# Altium schematic sheet Delenda.SchDoc: Top Sheet
size A3; SheetNumber: 1; SheetTotal: 6; DocumentName: Top Sheet
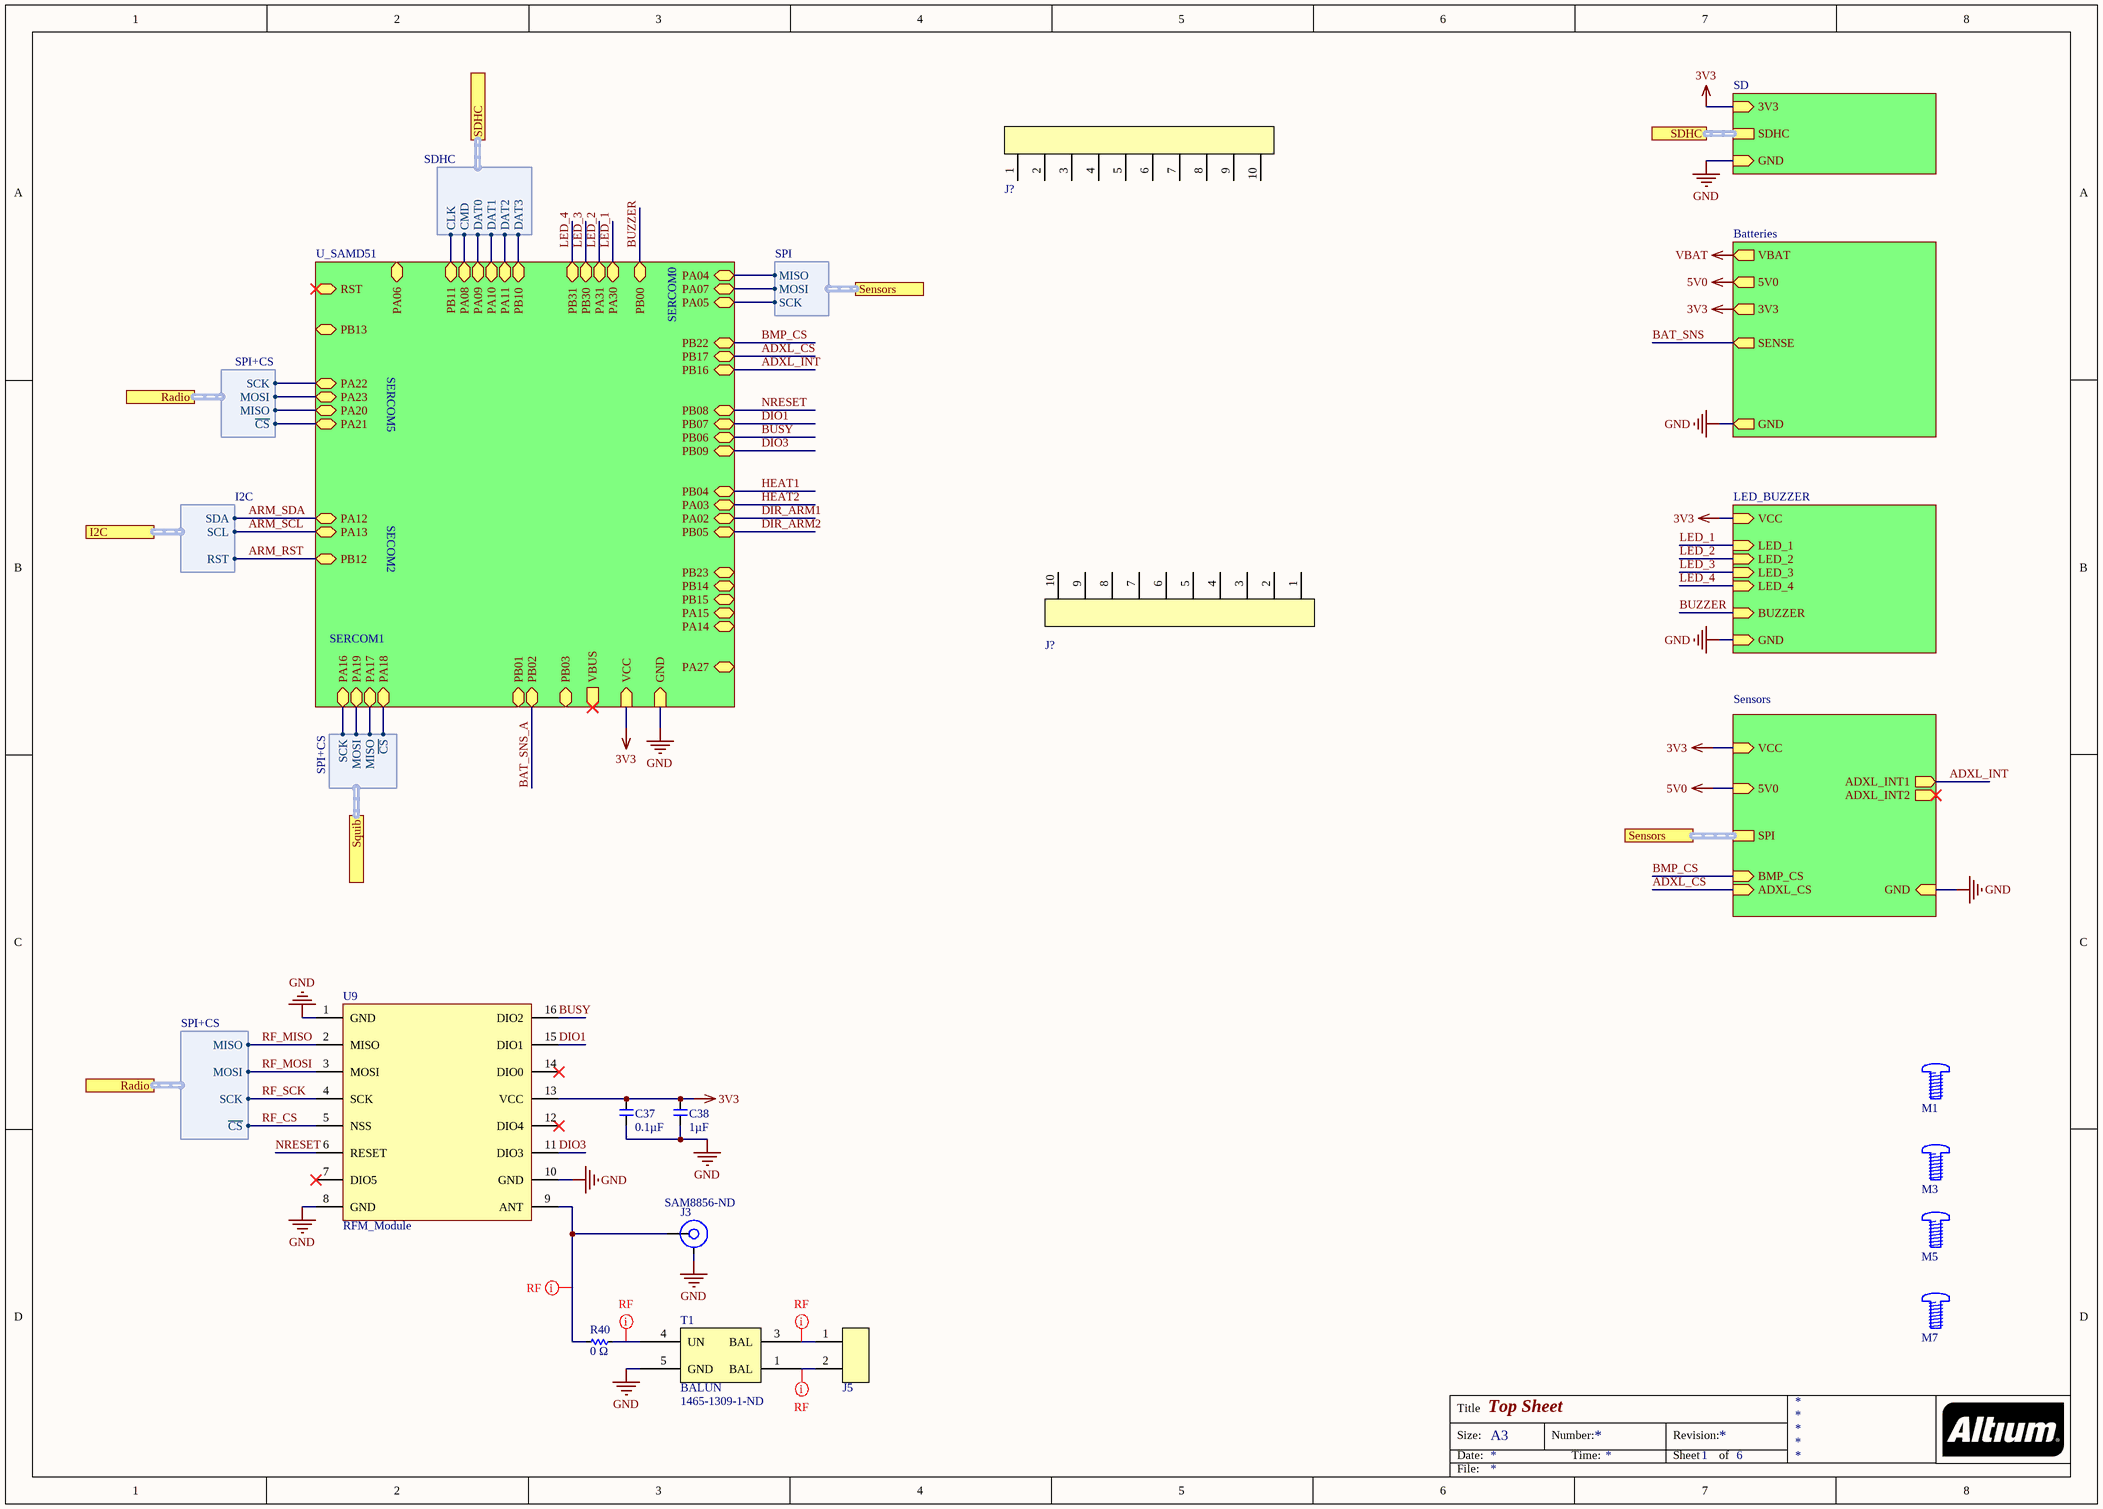
[diagram p0: Delenda.SchDoc]

## Parts
(Parts that share a designator on the sheet are numbered #1, #2 ... from top to bottom, then left to right.)
C37  Capacitance (shorthand): 0.1µF  [C0603]  (hidden comment: __template_cap)
C38  Capacitance (shorthand): 1µF  [C0603]  (hidden comment: __template_cap)
J3  Supplier Part Number 1: SAM8856-ND  [SMA_SAMTEC_SMA-J-P-X-RA-TH1]  (hidden comment: SMA_SAMTEC_TH_RA)
J5  CONN HEADER 2POS VERT T/H  [CONN_1x2_100MIL]  (value not drawn)
J?#1  CONN HEADER 10POS T/H  [CONN_1x10_100MIL]  (value not drawn)
J?#2  CONN HEADER 10POS T/H  [CONN_1x10_100MIL]  (value not drawn)
M1  SCREW_#4-40  [#4_HOLE]  (value not drawn)
M3  SCREW_#4-40  [#4_HOLE]  (value not drawn)
M5  SCREW_#4-40  [#4_HOLE]  (value not drawn)
M7  SCREW_#4-40  [#4_HOLE]  (value not drawn)
R40  Resistance: 0 Ω  [R0402]  (hidden comment: __template_resistor)
T1  BALUN  Supplier Part Number 1: 1465-1309-1-ND  [BALUN_MABA-010245-CT1160]
U9  RFM_Module  [RFM-22]

## Sub-sheets
Batteries = Battery_Management: SENSE (out), 5V0 (out), GND (out), 3V3 (out), VBAT (out)
LED_BUZZER = Blink_Blink_Beep_Boop: LED_1 (in), LED_2 (in), LED_3 (in), LED_4 (in), BUZZER (in), GND (in), VCC (in)
SD = SD.SchDoc: SDHC (harness SDHC), GND (in), 3V3 (in)
Sensors = Sensors.SchDoc: SPI (harness SPI), BMP_CS (in), ADXL_CS (in), ADXL_INT1 (out), ADXL_INT2 (out), GND (in), VCC (in), 5V0 (in)
U_SAMD51 = SAMD51.SchDoc: PA12 (bidir), PA13 (bidir), PA05 (bidir), PA07 (bidir), PA04 (bidir), PA06 (bidir), PB11 (bidir), PA08 (bidir), PA09 (bidir), PA10 (bidir), PA11 (bidir), PB10 (bidir), PB12 (bidir), PB13 (bidir), PA22 (bidir), PA23 (bidir), PA16 (bidir), PA19 (bidir), PA17 (bidir), PA20 (bidir), PA21 (bidir), PB08 (bidir), PB07 (bidir), PB06 (bidir), PB09 (bidir), PB04 (bidir), PA03 (bidir), PA02 (bidir), PB05 (bidir), PB00 (bidir), PB30 (bidir), PA31 (bidir), PA30 (bidir), PB31 (bidir), PB16 (bidir), PA14 (bidir), PB17 (bidir), PB23 (bidir), PB22 (bidir), PA27 (bidir), PB02 (bidir), PB01 (bidir), PB03 (bidir), PA18 (bidir), GND (in), VCC (in), VBUS (out), PB14 (bidir), PB15 (bidir), PA15 (bidir), RST (bidir)

## Ports
I2C (harness I2C), Radio (harness SPI+CS), SDHC, SDHC (harness SDHC), Sensors (harness SPI), Squib (harness SPI+CS)

## Harnesses
SPI: MISO, MOSI, SCK
SDHC: CLK, CMD, DAT0, DAT1, DAT2, DAT3
SPI+CS: MISO, MOSI, SCK, ~{CS}
I2C: SCL, SDA, RST

## Nets
3V3: C37.1 C38.1 U9.13(VCC) ; sheet Sensors/VCC, sheet Batteries/3V3, sheet LED_BUZZER/VCC, sheet U_SAMD51/VCC, sheet SD/3V3
5V0: sheet Sensors/5V0, sheet Batteries/5V0
GND: C37.2 C38.2 J3.GND T1.5(GND) U9.1(GND) U9.8(GND) U9.10(GND) ; sheet Sensors/GND, sheet Batteries/GND, sheet LED_BUZZER/GND, sheet U_SAMD51/GND, sheet SD/GND
VBAT: sheet Batteries/VBAT
ADXL_CS: sheet Sensors/ADXL_CS, sheet U_SAMD51/PB17
ADXL_INT: sheet Sensors/ADXL_INT1, sheet U_SAMD51/PB16
ARM_RST: sheet U_SAMD51/PB12, port I2C.RST
ARM_SCL: sheet U_SAMD51/PA13, port I2C.SCL
ARM_SDA: sheet U_SAMD51/PA12, port I2C.SDA
BAT_SNS: sheet Batteries/SENSE
BAT_SNS_A: sheet U_SAMD51/PB02
BMP_CS: sheet Sensors/BMP_CS, sheet U_SAMD51/PB22
BUSY: U9.16(DIO2) ; sheet U_SAMD51/PB06
BUZZER: sheet LED_BUZZER/BUZZER, sheet U_SAMD51/PB00
DIO1: U9.15(DIO1) ; sheet U_SAMD51/PB07
DIO3: U9.11(DIO3) ; sheet U_SAMD51/PB09
DIR_ARM1: sheet U_SAMD51/PA02
DIR_ARM2: sheet U_SAMD51/PB05
HEAT1: sheet U_SAMD51/PB04
HEAT2: sheet U_SAMD51/PA03
LED_1: sheet LED_BUZZER/LED_1, sheet U_SAMD51/PA30
LED_2: sheet LED_BUZZER/LED_2, sheet U_SAMD51/PA31
LED_3: sheet LED_BUZZER/LED_3, sheet U_SAMD51/PB30
LED_4: sheet LED_BUZZER/LED_4, sheet U_SAMD51/PB31
NRESET: U9.6(RESET) ; sheet U_SAMD51/PB08
RF_CS: U9.5(NSS) ; sheet U_SAMD51/PA21, port Radio.~{CS}
RF_MISO: U9.2(MISO) ; sheet U_SAMD51/PA20, port Radio.MISO
RF_MOSI: U9.3(MOSI) ; sheet U_SAMD51/PA23, port Radio.MOSI
RF_SCK: U9.4(SCK) ; sheet U_SAMD51/PA22, port Radio.SCK
NetJ3_SIG: J3.SIG R40.1 U9.9(ANT)
NetJ5_1: J5.1 T1.3(BAL)
NetJ5_2: J5.2 T1.1(BAL)
NetR40_2: R40.2 T1.4(UN)
(unnamed): sheet U_SAMD51/PA05, port Sensors.SCK
(unnamed): sheet U_SAMD51/PA07, port Sensors.MOSI
(unnamed): sheet U_SAMD51/PA04, port Sensors.MISO
(unnamed): sheet U_SAMD51/PB11, port SDHC.CLK
(unnamed): sheet U_SAMD51/PA08, port SDHC.CMD
(unnamed): sheet U_SAMD51/PA09, port SDHC.DAT0
(unnamed): sheet U_SAMD51/PA10, port SDHC.DAT1
(unnamed): sheet U_SAMD51/PA11, port SDHC.DAT2
(unnamed): sheet U_SAMD51/PB10, port SDHC.DAT3
(unnamed): sheet U_SAMD51/PA16, port Squib.SCK
(unnamed): sheet U_SAMD51/PA19, port Squib.MOSI
(unnamed): sheet U_SAMD51/PA17, port Squib.MISO
(unnamed): sheet U_SAMD51/PA18, port Squib.~{CS}

Not connected (* = marked no-connect by the designer): J?#1 1 2 3 4 5 6 7 8 9 10; J?#2 1 2 3 4 5 6 7 8 9 10; M1 HOLE(0); M3 HOLE(0); M5 HOLE(0); M7 HOLE(0); U9 7(DIO5)* 12(DIO4)* 14(DIO0)*

## Buses and harness runs
harness port SDHC = sheet SD/SDHC
harness port Sensors = sheet Sensors/SPI

## Layout directives
rule Clearance Constraint [Generic clearance = 0mil, and 21 value(s) for objects]: NetJ3_SIG, NetJ5_1, NetJ5_2, NetR40_2

## Notes on the sheet
- SERCOM0
- SERCOM5
- SECOM2
- SERCOM1
- Title
- Size:
- Date:
- A3
- Number:
- Time:
- Revision:
- Sheet
- of
- File:

## Library data of the parts
C37 = 490-1519-1-ND: CAP CER 0603 0.1µF X7R 50V 10%; Manufacturer: Murata Electronics North America; Capacitance - pF (Machine readable): #NAME?; type: capacitor; Rated Voltage: 50V; Supplier Part Number 1: 490-1519-1-ND; Dielectric: X7R; Supplier 1: Digikey
C38 = 490-3900-1-ND: CAP CER 0603 1µF X7R 16V 10%; Manufacturer: Murata Electronics North America; Capacitance - pF (Machine readable): #NAME?; type: capacitor; Rated Voltage: 16V; Supplier Part Number 1: 490-3900-1-ND; Dielectric: X7R; Supplier 1: Digikey
J5 = CONN_1x2: Manufacturer: FCI; Manufacturer Part Number: 77311-118-02LF; Connector Type: Header, Unshrouded; Number of Positions: 2; Number of Positions Loaded: All; Pitch: 0.100" (2.54mm); RoHS: RoHS Compliant; Category: Connectors, Interconnects; Contact Type: Male Pin; Number of Rows: 1; Row Spacing: -; Contact Mating Length: 0.230" (5.84mm); Mounting Type: Through Hole; Termination: Solder; Fastening Type: -; Features: -; Contact Finish: Gold, GXT™; Contact Finish Thickness: 30µin (0.76µm); Color: Black; Packaging: Bulk; ComponentLink1URL: http://portal.fciconnect.com/res/en/pdffiles/doc_search//77311.pdf; ComponentLink1Description: http://portal.fciconnect.com/res/en/pdffiles/doc_search//77311.pdf
J?#1 J?#2 = CONN_1x10
M1 M3 M5 M7 = SCREW_#4-40: #4-40 Button Head Screw
R40 = 311-0.0LRCT-ND: RES SMD 0 OHM JUMPER 1/16W 0402; Manufacturer Part Number: RC0402FR-070RL; Manufacturer: Yageo; Resistance (Sortable): 0; Power (Watts): 0.063W, 1/16W; Supplier Part Number 1: 311-0.0LRCT-ND; Supplier 1: Digikey; Datasheets: http://www.yageo.com/documents/recent/PYu-RC_Group_51_RoHS_L_9.pdf; Image: //media.digikey.com/Renders/Yageo%20Renders/0402-(1005-Metric).jpg; Tolerance: Jumper; Temperature Coefficient: -; Operating Temperature: -55°C ~ 155°C
J3 = SMA_SAMTEC_TH_RA: Supplier 1: Digi-Key
T1 = BALUN: Supplier 1: Digi-Key